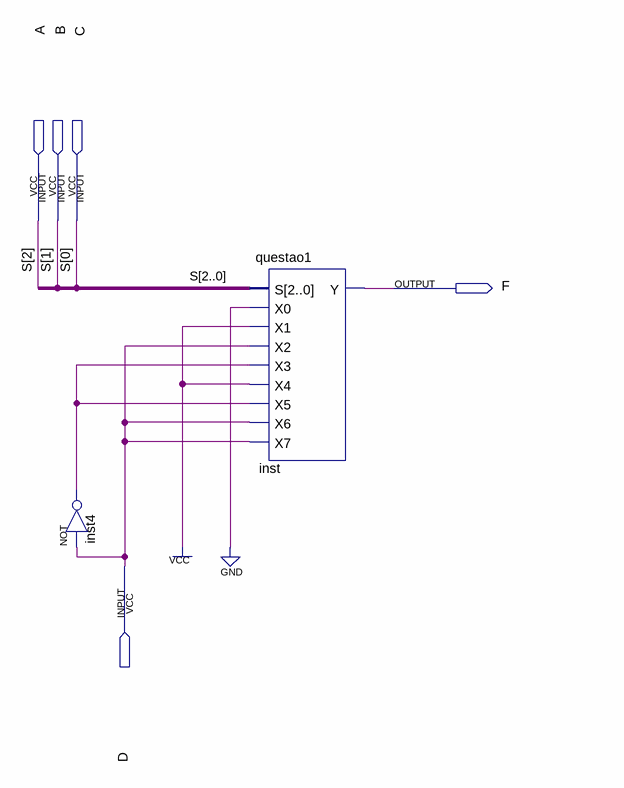
[diagram p0: schematic sheet]
// Quartus schematic quest3.bdf as structural Verilog: 2 symbols, 5 pins
module quest3 (
  input  A,
  input  B,
  input  C,
  input  D,
  output F
);

  wire inst4_out;

  not inst4 (inst4_out, D);
  questao1 inst (
    .S({A, B, C}), .X0(1'b0), .X1(1'b1), .X2(D), .X3(inst4_out), .X4(1'b1), .X5(inst4_out), .X6(D), .X7(D),
    .Y(F));

  // Other names for the same wires on the sheet: S[2:0] = {A, B, C}
endmodule
